# EAGLE design bistable-switch (EAGLE 9.6.2)
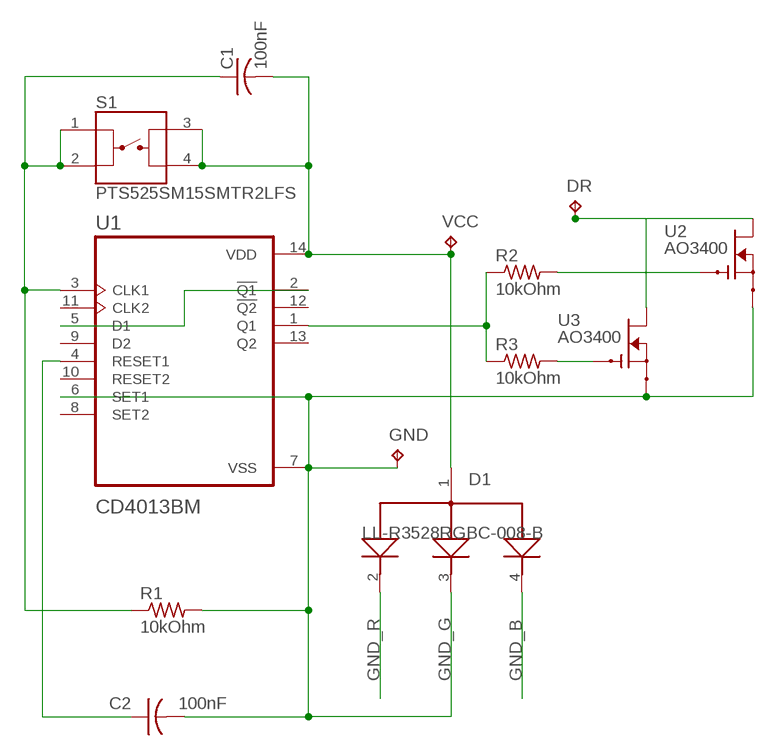
[diagram p0: schematic, sheet 1]

## Parts
C1  100nF  C-USC0805  [C0805]
C2  100nF  C-USC0805  [C0805]
D1  LL-R3528RGBC-008-B  [LED_LL-R3528RGBC-008-B]
DR  TPB1,27  [B1,27]
GND  TPB1,27  [B1,27]
R1  10kOhm  R-US_R0805  [R0805]
R2  10kOhm  R-US_R0805  [R0805]
R3  10kOhm  R-US_R0805  [R0805]
S1  PTS525SM15SMTR2LFS  [SW_PTS525SM15SMTR2LFS]
U1  CD4013BM  [SOIC127P600X175-14N]
U2  AO3400  [SOT23]
U3  AO3400  [SOT23]
VCC  TPB1,27  [B1,27]

## Nets
CLK1: C1.1 R1.1 S1.1 S1.2 U1.3(CLK1)
DRAIN: DR.TP U2.3(D) U3.3(D)
GATE_1: R2.2 U2.1(G)
GATE_2: R3.2 U3.1(G)
GND_B: D1.4(CATHODE_BLUE)
GND_G: C2.2 D1.3(CATHODE_GREEN) GND.TP R1.2 U1.6(SET1) U1.7(VSS) U2.2(S) U3.2(S)
GND_R: D1.2(CATHODE_RED)
N$1: U1.2(!Q1) U1.5(D1)
Q1: R2.1 R3.1 U1.1(Q1)
RST1: C2.1 U1.4(RESET1)
VDD: C1.2 D1.1(COMM_ANODE) S1.3 S1.4 U1.14(VDD) VCC.TP
Unconnected: U1.8(SET2) U1.9(D2) U1.10(RESET2) U1.11(CLK2) U1.12(!Q2) U1.13(Q2)

## Library data of the parts
C1 C2 = Tubescreamer:C-US: CAPACITOR, American symbol; SPICEPREFIX: C
D1 = LL-R3528RGBC-008-B:LL-R3528RGBC-008-B: LED; SMD; 3528, PLCC2; RGB; 3.5x2.8mm; 120°; Red lumin: 1 Check availability <https://pricing.snapeda.com/parts/LL-R3528RGBC-008-B/Lucky%20Light/view-part?ref=eda>; AVAILABILITY: Not in stock; CHECK_PRICES: https://www.snapeda.com/parts/LL-R3528RGBC-008-B/Lucky+Light/view-part/?ref=eda; DESCRIPTION: LED; SMD; 3528, PLCC2; RGB; 3.5x2.8mm; 120°; Red lumin: 1; MF: Lucky Light; MP: LL-R3528RGBC-008-B; PACKAGE: PLCC-2 Lucky Light; PRICE: None; SNAPEDA_LINK: https://www.snapeda.com/parts/LL-R3528RGBC-008-B/Lucky+Light/view-part/?ref=snap
DR GND VCC = BeagleBone_Blue_R3:TP: Test pad
R1-R3 = Tubescreamer:R-US_: RESISTOR, American symbol; SPICEPREFIX: R
S1 = PTS525SM15SMTR2LFS:PTS525SM15SMTR2LFS: Switch Tactile N.O. SPST Round Button Gull Wing 0.02A 15VDC 1000000Cycles 1.569N SMD T/R Check availability <https://pricing.snapeda.com/parts/PTS525SM15SMTR2LFS/C%26K/view-part?ref=eda>; AVAILABILITY: In Stock; CHECK_PRICES: https://www.snapeda.com/parts/PTS525SM15SMTR2LFS/C%2526K/view-part/?ref=eda; DESCRIPTION: Tactile Switch SPST-NO Top Actuated Surface Mount; MF: C&K; MP: PTS525SM15SMTR2LFS; PACKAGE: Tactile Switch CK; PRICE: None; SNAPEDA_LINK: https://www.snapeda.com/parts/PTS525SM15SMTR2LFS/C%2526K/view-part/?ref=snap
U1 = CD4013BM:CD4013BM: Check availability <https://pricing.snapeda.com/parts/CD4013BM/Texas%20Instruments/view-part?ref=eda>; AVAILABILITY: In Stock; CHECK_PRICES: https://www.snapeda.com/parts/CD4013BM/Texas+Instruments/view-part/?ref=eda; DESCRIPTION: CMOS Dual D-Type Flip Flop; MF: Texas Instruments; MP: CD4013BM; PACKAGE: SOIC-14 Texas Instruments; PRICE: None; PURCHASE-URL: https://www.snapeda.com/api/url_track_click_mouser/?unipart_id=41803&manufacturer=Texas Instruments&part_name=CD4013BM&search_term=None; SNAPEDA_LINK: https://www.snapeda.com/parts/CD4013BM/Texas+Instruments/view-part/?ref=snap
U2 U3 = AO3400:AO3400: Check availability <https://pricing.snapeda.com/parts/AO3400/Alpha%20%26/view-part?ref=eda>; AVAILABILITY: In Stock; CHECK_PRICES: https://www.snapeda.com/parts/AO3400/Alpha+%2526+Omega+Semiconductor+Inc./view-part/?ref=eda; DESCRIPTION: N-Channel 30 V 5.8A (Ta) 1.4W (Ta) Surface Mount SOT-23-3; MF: Alpha &; MP: AO3400; PACKAGE: SOT-23-3 Alpha &amp; Omega Semiconductor; PRICE: None; PURCHASE-URL: https://www.snapeda.com/api/url_track_click_mouser/?unipart_id=1321993&manufacturer=Alpha &amp;&part_name=AO3400&search_term=ao3400; SNAPEDA_LINK: https://www.snapeda.com/parts/AO3400/Alpha+%2526+Omega+Semiconductor+Inc./view-part/?ref=snap

## Board
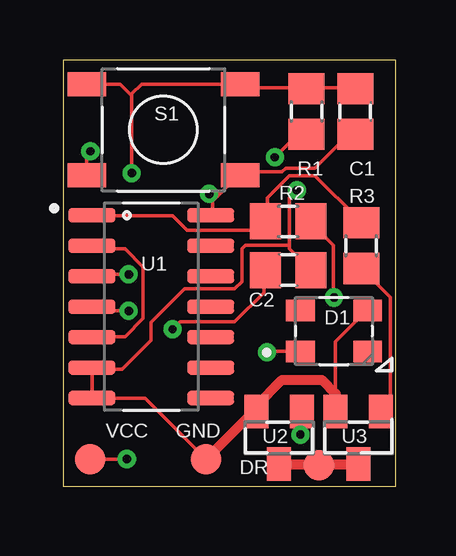
[diagram p1: board, top side]
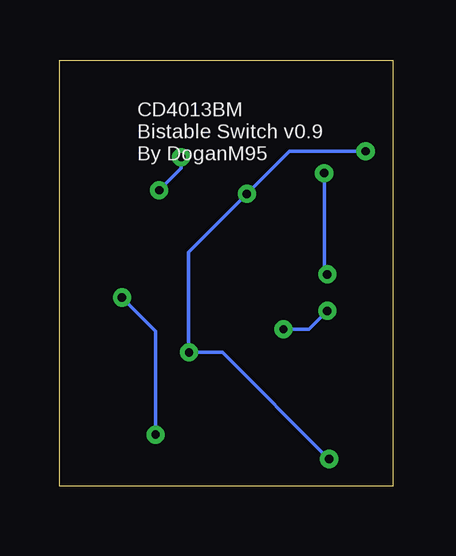
[diagram p2: board, bottom side, seen from below]

Size 13.89 x 17.77 mm. Coordinates in mm from the lower left corner, seen from the top.
Outline: 0,0 13.89,0 13.89,17.77 0,17.77 0,0
Copper layers (1*16): Top 0.035mm / dielectric 1.5mm / Bottom 0.035mm
Design rules "default *": minimum track width 6mil, minimum drill 0.35mm, track to track 6mil, track to pad 6mil, pad to pad 6mil, via to via 6mil, smd to smd 6mil, copper to edge 40mil, drill to drill 6mil, minimum pad ring 10mil, minimum via ring 8mil, stop-mask expansion 4mil, vias tented up to drill 20mil, thermal gap 10mil

### Footprints (pad centres in the part's own frame; a part is rotated, then mirrored left to right if it is on the bottom)
C0805 = smd 1.3 x 1.5: 1 -0.95,0; 2 0.95,0
LED_LL-R3528RGBC-008-B = smd 1.2 x 0.9: 1 -1.4,-0.85; 2 1.4,-0.85; 3 1.4,0.85; 4 -1.4,0.85
B1,27 = smd 1.27 x 1.27: TP 0,0
R0805 = smd 1.3 x 1.5: 1 -0.95,0; 2 0.95,0
SW_PTS525SM15SMTR2LFS = smd 1.6 x 1: 1 -3.2,1.9; 2 3.2,1.9; 3 -3.2,-1.9; 4 3.2,-1.9
SOIC127P600X175-14N = smd 1.97 x 0.6: 1 -2.475,3.81; 2 -2.475,2.54; 3 -2.475,1.27; 4 -2.475,0; 5 -2.475,-1.27; 6 -2.475,-2.54; 7 -2.475,-3.81; 8 2.475,-3.81; 9 2.475,-2.54; 10 2.475,-1.27; 11 2.475,0; 12 2.475,1.27; 13 2.475,2.54; 14 2.475,3.81
SOT23 = smd 1 x 1.4: 1 -0.95,-1.1; 2 0.95,-1.1; 3 0,1.1

### Placement (x,y rotation side)
C1  12.19,15.62 270 top
C2  9.4,9.02 0 top
D1  11.3,6.48 0 top
DR  10.67,0.89 0 top
GND  5.97,1.14 0 top
R1  10.16,15.62 270 top
R2  9.4,11.05 0 top
R3  12.45,10.03 270 top
S1  4.19,14.86 0 top
U1  3.68,7.49 0 top
U2  9.02,2.03 180 top
U3  12.32,2.03 180 top
VCC  1.14,1.14 0 top

### Tracks (layer width: path | path; a pad name or v marks a point on that pad's centre or on a via)
CLK1  (via drill 0.35)
  Top 0.152: C1.1 12.19,16.61 10.21,16.61 R1.1 10.06,16.61 7.47,16.61 S1.2 3.27,16.76 2.87,16.36 v2.87,13.06 2.87,16.28 2.39,16.76 S1.1 | v2.74,8.84 1.22,8.84 U1.3
  Bottom 0.152: v2.87,13.06 2.87,8.97 v2.74,8.84
DRAIN
  Top 0.152: 12.19,0.96 U3.3
  Top 0.406: U2.3 10.62,0.93 DR.TP 10.71,0.93 U3.3
GATE_1  (via drill 0.35)
  Top 0.152: 10.06,3.25 U2.1 9.97,2.22 v9.91,2.16 | R2.2 10.36,10.97 11.28,10.06 11.28,7.9 v11.3,7.87
  Bottom 0.152: v9.91,2.16 9.91,6.48 v11.3,7.87
GATE_2
  Top 0.152: R3.2 13.65,7.88 13.65,3.51 U3.1
GND_G  (via drill 0.35)
  Top 0.152: D1.3 12.65,7.31 11.37,6.04 11.37,3.81 U3.2 11.28,3.1 | GND.TP 3.43,3.68 U1.7 1.22,3.81 1.22,4.88 | 1.22,4.88 U1.6 | v8.84,13.72 9.75,14.63 10.06,14.63 R1.2 | v9.75,12.34 9.45,12.04 9.45,10.06 | 9.45,10.06 9.45,9.91 10.21,9.14 C2.2 | 9.45,10.06 7.62,10.06 7.47,9.91 7.47,8.53 7.16,8.23 5.08,8.23 3.68,6.83 3.68,6.1 2.46,4.88 1.22,4.88 | 8.38,3.1 8.08,3.1 U2.2 8.38,3.1
  Top 0.254: 8.08,3 8.08,3.1
  Top 0.406: 11.37,3.49 U3.2 | 8.07,3.39 U2.2 8.07,3.37 9.14,4.45 10.79,4.45 11.37,3.87 11.37,3.81 | GND.TP 7.92,3.1 8.08,3.1
  Bottom 0.152: v8.84,13.72 8.84,13.26 v9.75,12.34
N$1
  Top 0.152: U1.5 1.22,6.25 2.59,6.25 3.35,7.01 3.35,9.14 2.59,9.91 1.22,9.91 U1.2
Q1
  Top 0.152: R3.1 12.34,11.12 10.52,12.95 9.45,12.95 8.53,12.04 8.53,11.12 R2.1 8.38,10.97 8.08,10.67 5.18,10.67 4.57,11.28 1.22,11.28 U1.1
RST1  (via drill 0.35)
  Top 0.152: v4.57,6.55 4.88,6.86 7.16,6.86 8.38,8.08 8.38,8.99 C2.1 | v2.74,7.32 1.37,7.32 1.22,7.47 U1.4
  Bottom 0.152: v4.57,6.55 3.5,6.55 v2.74,7.32
VDD  (via drill 0.35)
  Top 0.152: C1.2 12.19,14.63 11.89,14.63 10.52,13.26 9.3,13.26 9.14,13.11 7.47,13.11 S1.4 7.32,12.95 6.55,12.19 | 6.55,12.19 6.25,11.89 6.25,11.43 U1.14 | 6.55,12.19 v6.1,12.19 | S1.3 0.99,13.82 v1.14,13.97 | VCC.TP v2.67,1.14 | D1.1 8.55,5.63 v8.51,5.59
  Bottom 0.152: v1.14,13.97 4.32,13.97 v6.1,12.19 8.53,9.75 8.53,5.61 v8.51,5.59 7.11,5.59 v2.67,1.14

### Text on the board
bNames: CD4013BM / Bistable Switch v0.9 / By DoganM95